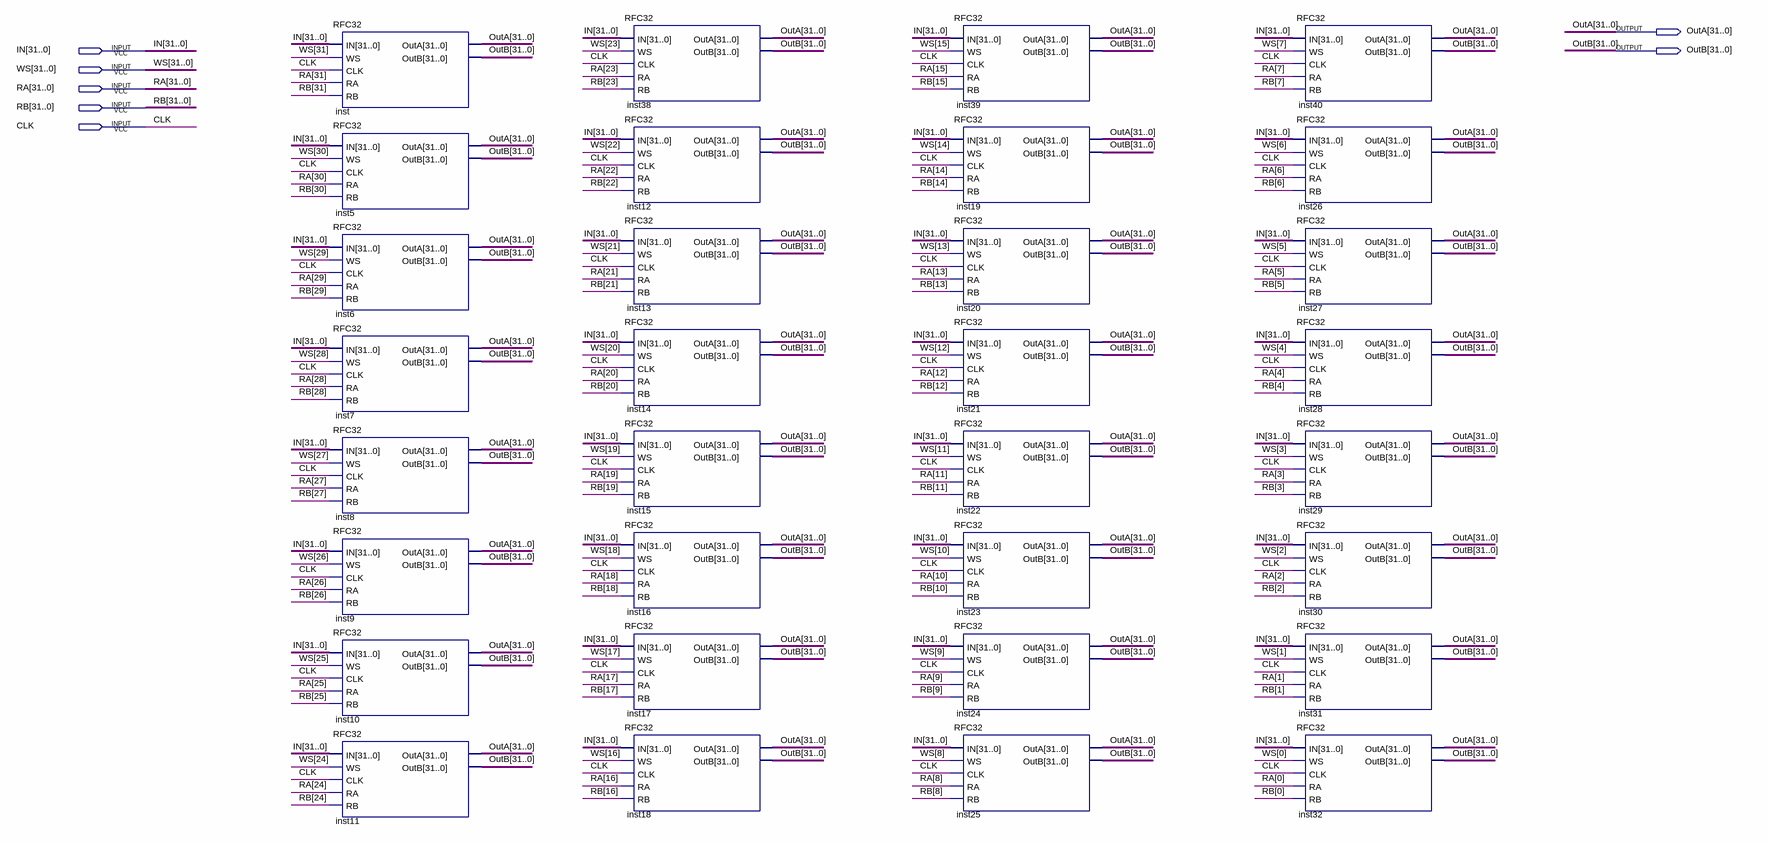
[diagram p0: schematic sheet]
// Quartus schematic RFC32x32.bdf as structural Verilog: 32 symbols, 7 pins
module RFC32x32 (
  input  [31:0] IN,
  input  [31:0] WS,
  input  [31:0] RA,
  input  [31:0] RB,
  input  CLK,
  output [31:0] OutA,
  output [31:0] OutB
);

  RFC32 inst (.IN(IN), .WS(WS[31]), .CLK(CLK), .RA(RA[31]), .RB(RB[31]), .OutA(OutA), .OutB(OutB));
  RFC32 inst5 (.IN(IN), .WS(WS[30]), .CLK(CLK), .RA(RA[30]), .RB(RB[30]), .OutA(OutA), .OutB(OutB));
  RFC32 inst6 (.IN(IN), .WS(WS[29]), .CLK(CLK), .RA(RA[29]), .RB(RB[29]), .OutA(OutA), .OutB(OutB));
  RFC32 inst7 (.IN(IN), .WS(WS[28]), .CLK(CLK), .RA(RA[28]), .RB(RB[28]), .OutA(OutA), .OutB(OutB));
  RFC32 inst8 (.IN(IN), .WS(WS[27]), .CLK(CLK), .RA(RA[27]), .RB(RB[27]), .OutA(OutA), .OutB(OutB));
  RFC32 inst9 (.IN(IN), .WS(WS[26]), .CLK(CLK), .RA(RA[26]), .RB(RB[26]), .OutA(OutA), .OutB(OutB));
  RFC32 inst10 (.IN(IN), .WS(WS[25]), .CLK(CLK), .RA(RA[25]), .RB(RB[25]), .OutA(OutA), .OutB(OutB));
  RFC32 inst11 (.IN(IN), .WS(WS[24]), .CLK(CLK), .RA(RA[24]), .RB(RB[24]), .OutA(OutA), .OutB(OutB));
  RFC32 inst38 (.IN(IN), .WS(WS[23]), .CLK(CLK), .RA(RA[23]), .RB(RB[23]), .OutA(OutA), .OutB(OutB));
  RFC32 inst12 (.IN(IN), .WS(WS[22]), .CLK(CLK), .RA(RA[22]), .RB(RB[22]), .OutA(OutA), .OutB(OutB));
  RFC32 inst13 (.IN(IN), .WS(WS[21]), .CLK(CLK), .RA(RA[21]), .RB(RB[21]), .OutA(OutA), .OutB(OutB));
  RFC32 inst14 (.IN(IN), .WS(WS[20]), .CLK(CLK), .RA(RA[20]), .RB(RB[20]), .OutA(OutA), .OutB(OutB));
  RFC32 inst15 (.IN(IN), .WS(WS[19]), .CLK(CLK), .RA(RA[19]), .RB(RB[19]), .OutA(OutA), .OutB(OutB));
  RFC32 inst16 (.IN(IN), .WS(WS[18]), .CLK(CLK), .RA(RA[18]), .RB(RB[18]), .OutA(OutA), .OutB(OutB));
  RFC32 inst17 (.IN(IN), .WS(WS[17]), .CLK(CLK), .RA(RA[17]), .RB(RB[17]), .OutA(OutA), .OutB(OutB));
  RFC32 inst18 (.IN(IN), .WS(WS[16]), .CLK(CLK), .RA(RA[16]), .RB(RB[16]), .OutA(OutA), .OutB(OutB));
  RFC32 inst39 (.IN(IN), .WS(WS[15]), .CLK(CLK), .RA(RA[15]), .RB(RB[15]), .OutA(OutA), .OutB(OutB));
  RFC32 inst19 (.IN(IN), .WS(WS[14]), .CLK(CLK), .RA(RA[14]), .RB(RB[14]), .OutA(OutA), .OutB(OutB));
  RFC32 inst20 (.IN(IN), .WS(WS[13]), .CLK(CLK), .RA(RA[13]), .RB(RB[13]), .OutA(OutA), .OutB(OutB));
  RFC32 inst21 (.IN(IN), .WS(WS[12]), .CLK(CLK), .RA(RA[12]), .RB(RB[12]), .OutA(OutA), .OutB(OutB));
  RFC32 inst22 (.IN(IN), .WS(WS[11]), .CLK(CLK), .RA(RA[11]), .RB(RB[11]), .OutA(OutA), .OutB(OutB));
  RFC32 inst23 (.IN(IN), .WS(WS[10]), .CLK(CLK), .RA(RA[10]), .RB(RB[10]), .OutA(OutA), .OutB(OutB));
  RFC32 inst24 (.IN(IN), .WS(WS[9]), .CLK(CLK), .RA(RA[9]), .RB(RB[9]), .OutA(OutA), .OutB(OutB));
  RFC32 inst25 (.IN(IN), .WS(WS[8]), .CLK(CLK), .RA(RA[8]), .RB(RB[8]), .OutA(OutA), .OutB(OutB));
  RFC32 inst40 (.IN(IN), .WS(WS[7]), .CLK(CLK), .RA(RA[7]), .RB(RB[7]), .OutA(OutA), .OutB(OutB));
  RFC32 inst26 (.IN(IN), .WS(WS[6]), .CLK(CLK), .RA(RA[6]), .RB(RB[6]), .OutA(OutA), .OutB(OutB));
  RFC32 inst27 (.IN(IN), .WS(WS[5]), .CLK(CLK), .RA(RA[5]), .RB(RB[5]), .OutA(OutA), .OutB(OutB));
  RFC32 inst28 (.IN(IN), .WS(WS[4]), .CLK(CLK), .RA(RA[4]), .RB(RB[4]), .OutA(OutA), .OutB(OutB));
  RFC32 inst29 (.IN(IN), .WS(WS[3]), .CLK(CLK), .RA(RA[3]), .RB(RB[3]), .OutA(OutA), .OutB(OutB));
  RFC32 inst30 (.IN(IN), .WS(WS[2]), .CLK(CLK), .RA(RA[2]), .RB(RB[2]), .OutA(OutA), .OutB(OutB));
  RFC32 inst31 (.IN(IN), .WS(WS[1]), .CLK(CLK), .RA(RA[1]), .RB(RB[1]), .OutA(OutA), .OutB(OutB));
  RFC32 inst32 (.IN(IN), .WS(WS[0]), .CLK(CLK), .RA(RA[0]), .RB(RB[0]), .OutA(OutA), .OutB(OutB));
endmodule
